# EAGLE design tweeq-FB_Audio (EAGLE 7.2.0)
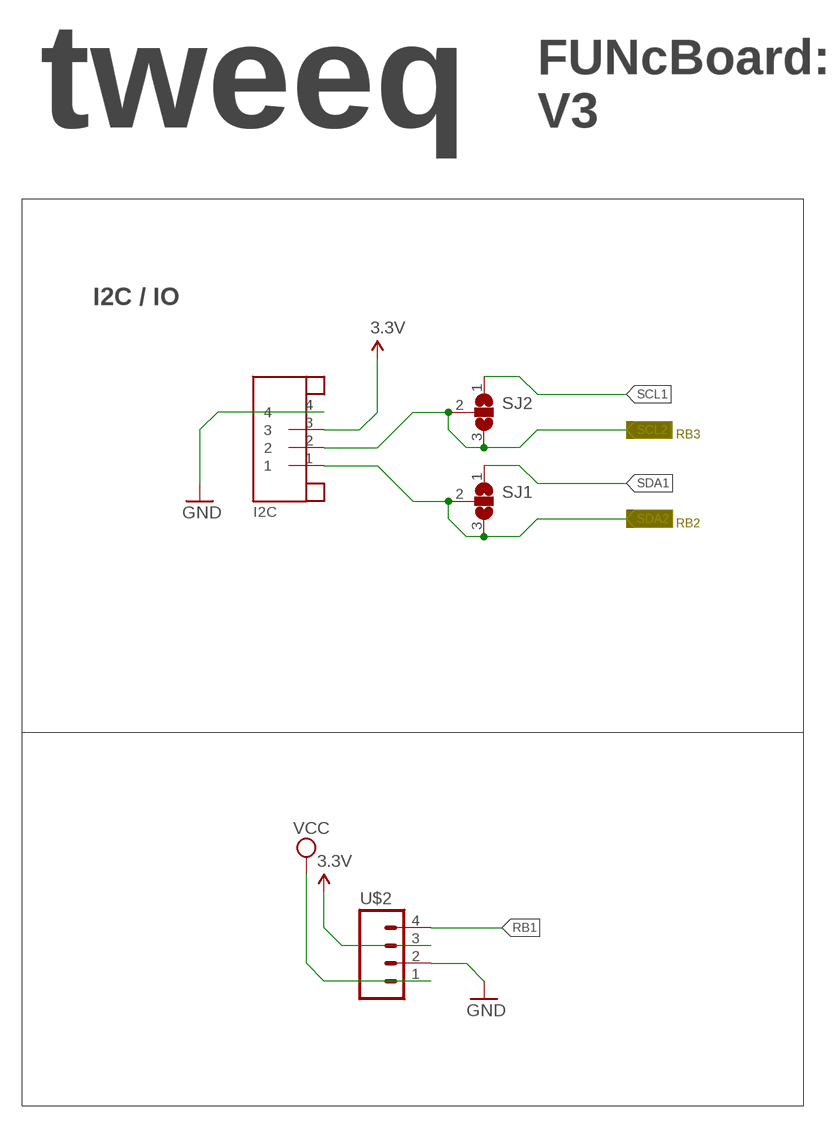
[diagram p0: schematic, sheet 1, part 1 of 2]
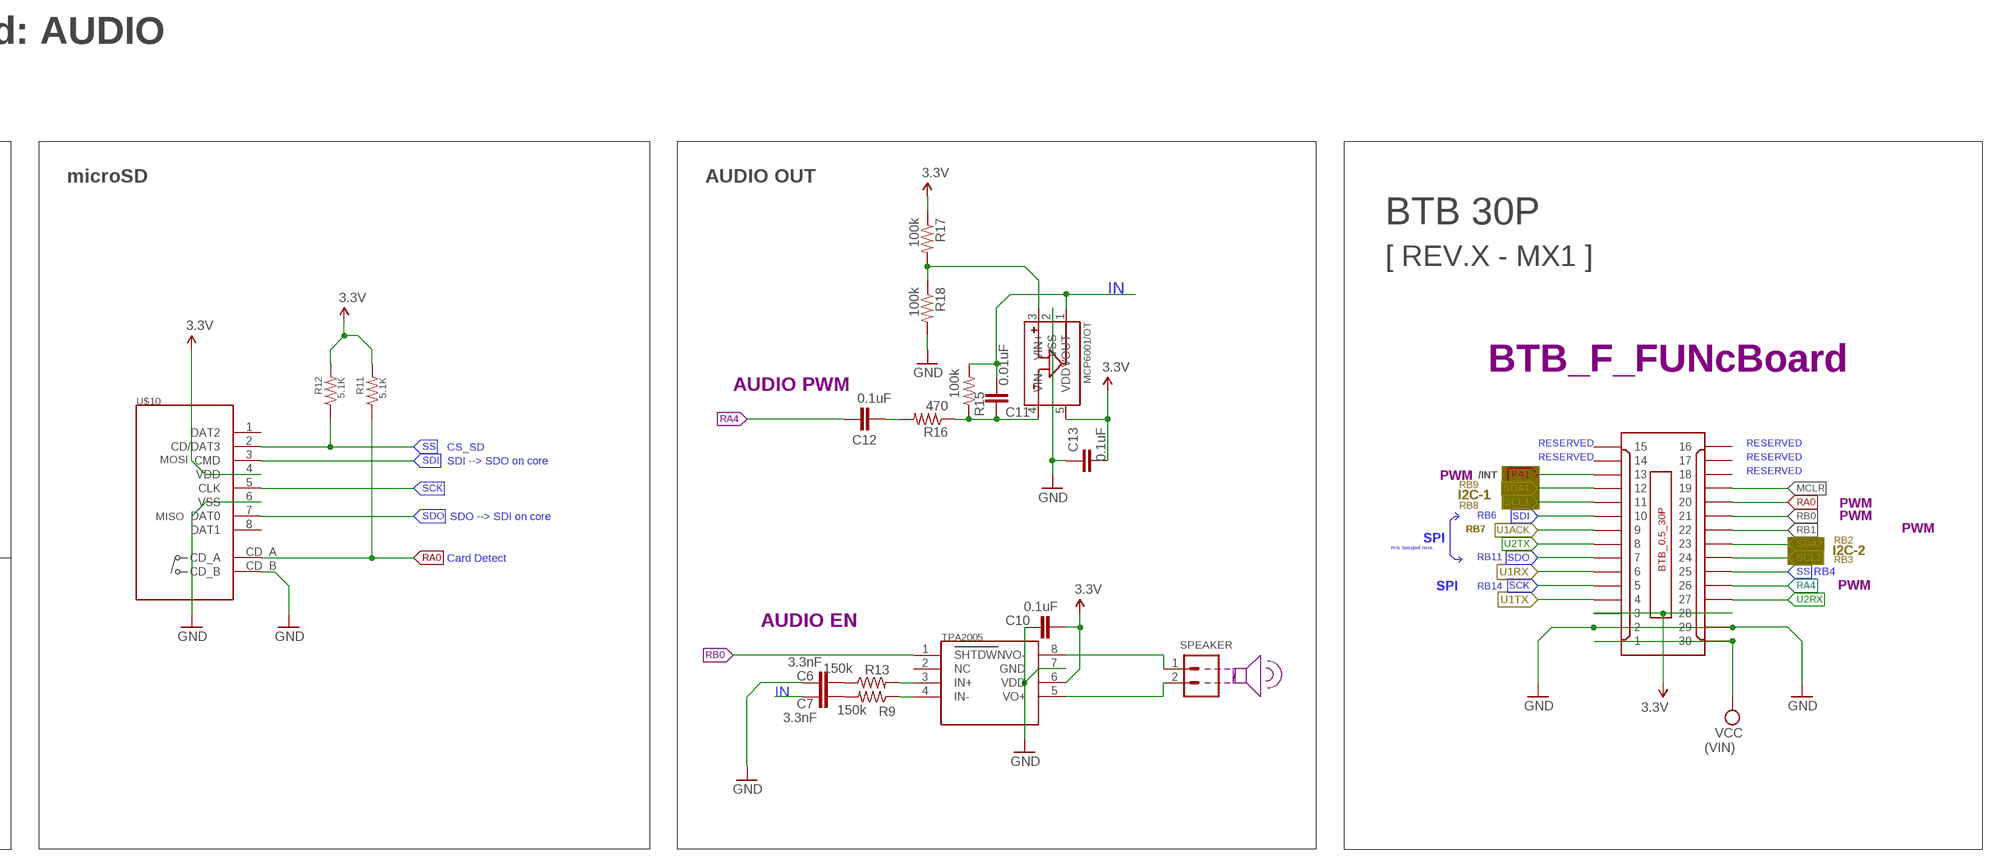
[diagram p1: schematic, sheet 1, part 2 of 2]

## Parts
C6  3.3nF  C-EUC0402  [C0402]
C7  3.3nF  C-EUC0402  [C0402]
C10  0.1uF  C-EUC0402  [C0402]
C11  0.01uF  C-EUC0402  [C0402]
C12  0.1uF  C-EUC0402  [C0402]
C13  0.1uF  C-EUC0402  [C0402]
I2C  JST-4PINSH  [SH1.0-4PIN]
MCP6001/OT  MCP6001/OT  [SOT23-5]
R9  150k  R-US_R0402  [R0402]
R11  5.1K  R-US_R0402  [R0402]
R12  5.1K  R-US_R0402  [R0402]
R13  150k  R-US_R0402  [R0402]
R15  100k  R-US_R0402  [R0402]
R16  470  RESISTOR0402-RES  [0402-RES]
R17  100k  R-US_R0402  [R0402]
R18  100k  R-US_R0402  [R0402]
SJ1  JUMPER_SJ2WS  [JUMPER_SJ_S]
SJ2  JUMPER_SJ2WS  [JUMPER_SJ_S]
SPEAKER  LOUDSPEAKER  M02PTH  [1X02]
TPA2005  TPA2005  [MSOP8]
U$1  BTB_CONN_30P/F  [BTB0.5-30F-3.0G]
U$2  M04  [1X04_PAD]
U$10  MICROSD_DM3D  [DM3D-SF]

## Nets
3.3V: C10.2 C13.2 I2C.3 MCP6001/OT.5(VDD) R11.2 R12.2 R17.1 TPA2005.6(VDD) U$1.3 U$1.28 U$2.3 U$10.4(VDD)
GND: C6.1 C10.1 C13.1 I2C.4 MCP6001/OT.2(VSS) R18.2 TPA2005.7(GND) U$1.2 U$1.29 U$2.2 U$10.6(VSS) U$10.CD_B
IN: C7.2 C11.2 MCP6001/OT.1(VOUT) R15.2
MCLR: U$1.19
N$12: R9.1 TPA2005.4(IN-)
N$13: C7.1 R9.2
N$14: R13.2 TPA2005.3(IN+)
N$22: C6.2 R13.1
N$23: SPEAKER.1 TPA2005.8(VO-)
N$24: SPEAKER.2 TPA2005.5(VO+)
N$25: C12.2 R16.2
N$26: C11.1 MCP6001/OT.4(VIN-) R15.1 R16.1
N$27: MCP6001/OT.3(VIN+) R17.2 R18.1
RA0: R11.1 U$1.20 U$10.CD_A
RA1: U$1.13
RA4: C12.1 U$1.26
RB0: TPA2005.1(SHTDWN) U$1.21
RB1: U$1.22 U$2.4
SCK: U$1.5 U$10.5(CLK)
SCL1: SJ2.1 U$1.11
SCL2: I2C.2 SJ2.2 SJ2.3 U$1.24
SDA1: SJ1.1 U$1.12
SDA2: I2C.1 SJ1.2 SJ1.3 U$1.23
SDI: U$1.10 U$10.3(CMD)
SDO: U$1.7 U$10.7(DAT0)
SS: R12.1 U$1.25 U$10.2(CD/DAT3)
U1ACK: U$1.9
U1RX: U$1.6
U1TX: U$1.4
U2RX: U$1.27
U2TX: U$1.8
VCC: U$1.1 U$1.30 U$2.1
Unconnected: TPA2005.2(NC) U$1.14 U$1.15 U$1.16 U$1.17 U$1.18 U$10.1(DAT2) U$10.8(DAT1)

## Notes on the sheet
- FUNcBoard: AUDIO
- tweeq | V3
- microSD | AUDIO OUT
- I2C / IO | BTB 30P
- [ REV.X - MX1 ]
- RB3
- BTB_F_FUNcBoard
- AUDIO PWM
- RB2
- RESERVED | RESERVED
- CS_SD
- RESERVED | RESERVED
- MOSI | SDI --> SDO on core
- PWM | /INT
- RESERVED
- RB9
- I2C-1
- I2C-1
- RB8 | PWM
- MISO | SDO --> SDI on core | RB6 | PWM
- RB7
- SPI | PWM
- RB2
- Pins Swapped Here.
- I2C-2
- Card Detect | RB11 | I2C-2
- RB3
- RB4
- SPI
- RB14 | PWM
- AUDIO EN
- (VIN)

## Library data of the parts
C6 C7 C10-C13 = AISCube:C-EU: CAPACITOR, European symbol
I2C = AISCube:JST-4PIN: JST 4 Pin
MCP6001/OT = AISCube:MCP6001: MCP6001 1 MHz Bandwidth Low Power Op Amp
R9 R13 R15 R17 R18 = AISCube:R-US_: RESISTOR, American symbol
R11 R12 = rcl:R-US_: RESISTOR, American symbol
R16 = SparkFun:RESISTOR: Resistor Basic schematic elements and footprints for 0603, 1206, and PTH resistors.
SJ1 SJ2 = AISCube:JUMPER_SJ2W: SMD solder JUMPER
SPEAKER = AISCube:M02: Header 2 Standard 2-pin 0.1" header. Use with straight break away headers (SKU : PRT-00116), right angle break away headers (PRT-00553), swiss pins (PRT-00743), machine pins (PRT-00117), and female headers (PRT-00115). Molex polarized connector foot print use with SKU : PRT-08233 with associated crimp pins and housings.
TPA2005 = AISCube:TPA2005: TPA2005 1.4-W MONO FILTER-FREE CLASS-D AUDIO POWER AMPLIFIER
U$1 = AISCube:BTB_CONN_30P: Board to Board Connector SMD 0.5mm Pitch 30 way - Dual Side (2x15) Total Mating height: 3.0mm
U$2 = AISCube:M04: 1x04 Pin Header Standard 2.54mm (0.1") header.
U$10 = AISCube:MICROSD_DM3D: DM3D-SF HRS (HIROSE) - DM3D-SF - CONNECTOR, MICRO SD, PUSH PULL, SMT, R/A Manufacturer: HRS (HIROSE) Order Code: 1764377RL (e14) Manufacturer Part No: DM3D-SF

## Board
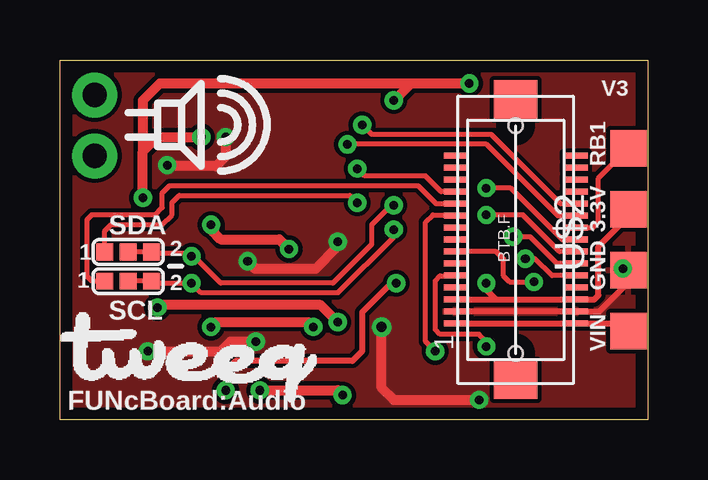
[diagram p2: board, top side]
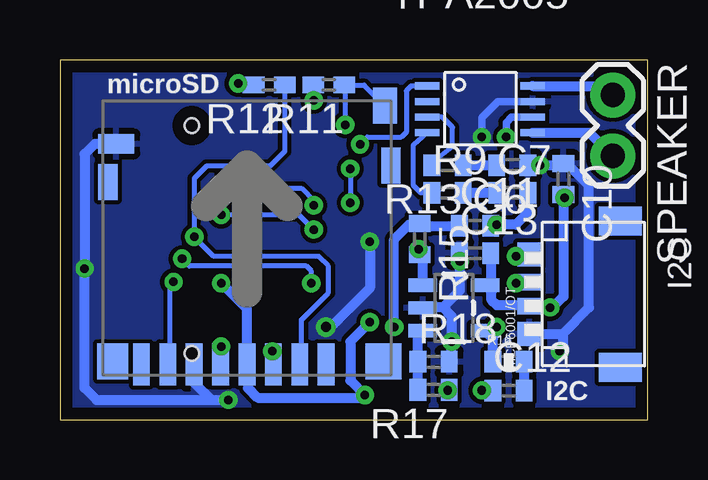
[diagram p3: board, bottom side, seen from below]

Size 24.5 x 15 mm. Coordinates in mm from the lower left corner, seen from the top.
Outline: 0,15 24.5,15 24.5,0 0,0 0,15
Copper layers (1*16): Top 0.0356mm / dielectric 1.5011mm / Bottom 0.0356mm
Design rules "AISCube": minimum track width 7mil, minimum drill 14mil, track to track 7mil, track to pad 7mil, pad to pad 7mil, via to via 7mil, smd to smd 0mil, copper to edge 20mil, drill to drill 8mil, minimum pad ring 10mil, minimum via ring 8mil, stop-mask expansion 4mil, vias tented up to drill 32mil, thermal gap 10mil

### Footprints (pad centres in the part's own frame; a part is rotated, then mirrored left to right if it is on the bottom)
C0402 = smd 0.7 x 0.9: 1 -0.65,0; 2 0.65,0
SH1.0-4PIN = smd 1 x 1: 1 -1.65,-0.55; 4 1.65,-0.55 | smd 0.7 x 1: 2 -0.5,-0.55; 3 0.5,-0.55 | smd 1.2 x 1.8: P$1 -3.05,3.25; P$2 3.05,3.25
SOT23-5 = smd 0.55 x 1.2: 1 -0.95,-1.3; 2 0,-1.3; 3 0.95,-1.3; 4 0.95,1.3; 5 -0.95,1.3
R0402 = smd 0.7 x 0.9: 1 -0.65,0; 2 0.65,0
R0402' = smd 0.9 x 0.7: 1 -0.65,0; 2 0.65,0
0402-RES = smd 0.7 x 0.9: 1 -0.65,0; 2 0.65,0
JUMPER_SJ_S = smd 0.7 x 0.7: 1 -0.974,-0.02; 2 0,-0.02; 3 0.974,-0.02
1X02 = drill 1.016 pad 1.88: 1 0,0; 2 2.54,0
MSOP8 = smd 1.02 x 0.3: 1 -2,-0.55; 2 -2,-1.2; 3 -2,-1.85; 4 -2,-2.5; 5 2.4,-2.5; 6 2.4,-1.85; 7 2.4,-1.2; 8 2.4,-0.55
BTB0.5-30F-3.0G = smd 0.25 x 1: 1 -3.495,2.49; 2 -2.995,2.49; 3 -2.495,2.49; 4 -1.995,2.49; 5 -1.495,2.49; 6 -0.995,2.49; 7 -0.495,2.49; 8 0.005,2.49; 9 0.505,2.49; 10 1.005,2.49; 11 1.505,2.49; 12 2.005,2.49; 13 2.505,2.49; 14 3.005,2.49; 15 3.505,2.49; 16 3.505,-2.51; 17 3.005,-2.51; 18 2.505,-2.51; 19 2.005,-2.51; 20 1.505,-2.51; 21 1.005,-2.51; 22 0.505,-2.51; 23 0.005,-2.51; 24 -0.495,-2.51; 25 -0.995,-2.51; 26 -1.495,-2.51; 27 -1.995,-2.51; 28 -2.495,-2.51; 29 -2.995,-2.51; 30 -3.495,-2.51 | smd 1.6 x 1.8: P$1 -5.845,0; P$2 5.855,0 | hole 0.6: -4.745,0; 4.755,0
1X04_PAD = smd 1.524 x 1.524: 1 -3.81,0; 2 -1.27,0; 3 1.27,0; 4 3.81,0
DM3D-SF = smd 0.7 x 1.75: 1 3.3,0; 2 2.2,0; 3 1.1,0; 4 0,0; 5 -1.1,0; 6 -2.2,0; 7 -3.3,0; 8 -4.4,0 | smd 1 x 1.5: CD_A 5.75,10.8 | smd 1.5 x 0.8: CD_B -5.45,9.2 | smd 1.3 x 1.5: M0 -5.6,0.12 | smd 1.5 x 1.5: M1 5.7,0.12 | smd 0.8 x 1.5: M2 -5.8,7.6; M3 6,8.3

### Placement (x,y rotation side)
C6  5.64,10.61 180 bottom
C7  5.64,9.45 0 bottom
C10  3.51,10.03 270 bottom
C11  7.19,8.08 0 bottom
C12  5.8,1.21 0 bottom
C13  7.19,6.94 0 bottom
I2C  4.38,5.23 270 bottom
MCP6001/OT  8.07,4.66 270 bottom
R9  8.33,9.45 0 bottom
R11  5.1K  [R0402']  13.29,13.96 180 bottom
R12  5.1K  [R0402']  15.78,13.96 180 bottom
R13  8.33,10.61 180 bottom
R15  9.5,7.52 270 bottom
R16  5.8,2.41 0 bottom
R17  8.92,1.24 180 bottom
R18  8.92,2.41 0 bottom
SJ1  2.84,7.01 0 top
SJ2  2.84,5.79 0 top
SPEAKER  1.45,13.53 270 bottom
TPA2005  7.19,14.46 0 bottom
U$1  19,7.5 90 top
U$2  23.7,7.5 90 top
U$4  [TWEEQ-LOGO-L]  0,0.71 0 top
U$10  16.7,2.3 0 bottom

### Tracks (layer width: path | path; a pad name or v marks a point on that pad's centre or on a via)
3.3V  (via drill 0.36)
  Top 0.254: U$1.3 18.19,5 | 18.19,5 U$1.28 22.28,5 22.45,5.18 22.45,7.21 23.7,8.46 U$2.3 | v17.78,5.69 17.78,5.41 18.19,5
  Top 0.406: v8.33,1.22 11.58,1.22 v11.79,1.02 | 3.45,11.18 4.06,11.79 v5.89,11.79 | v17.07,14.02 14.63,14.02 | 14.63,14.02 v13.92,13.31 | v3.45,9.25 3.45,11.18 | 14.63,14.02 4.17,14.02 3.45,13.31 3.45,11.18 | v11.58,4.06 10.87,4.78 4.17,4.78 v4.06,4.67
  Bottom 0.305: TPA2005.6 5.67,12.61 5.89,12.39 v5.89,11.79
  Bottom 0.406: C13.2 6.54,5.84 MCP6001/OT.5 6.5,5.34 6.5,4.98 6.3,4.78 4.97,4.78 I2C.3 4.88,4.78 4.78,4.67 v4.06,4.67 3.96,4.67 3.51,5.13 C10.2 3.51,8.99 v3.45,9.25 | v11.58,4.06 12.39,3.25 12.39,1.63 v11.79,1.02 11.89,0.91 16.26,0.91 16.66,1.32 16.66,2.26 U$10.4 16.7,4.61 v17.78,5.69 | R17.1 8.31,1.24 v8.33,1.22 | R12.2 16.49,14.02 v17.07,14.02 | v13.92,13.31 13.92,13.94 R11.2
GND  (via drill 0.36, 0.41)
  Top 0.254: U$1.2 U$1.29 22.49,4.5 23.7,5.72 U$2.2 | 23.37,5.59 v23.47,6.3
  Top 0.406: v3.66,2.85 6.71,2.85 7.11,3.25 v8.17,3.25 | v13.41,3.86 13.41,1.33 13.92,0.82 v17.48,0.82 | v6.91,11.79 6.91,10.97 6.5,10.57 4.52,10.57 v4.47,10.61 | v7.82,6.6 8.13,6.3 10.67,6.3 11.58,7.21 v11.58,7.42 | U$2.2 23.44,6.23 v23.47,6.3
  Bottom 0.305: TPA2005.7 6.24,13.26 6.91,12.6 v6.91,11.79
  Bottom 0.406: 8.53,4.67 9.36,4.67 MCP6001/OT.2 9.39,4.67 | 8.53,4.67 7.82,5.38 v7.82,6.6 7.82,6.92 C13.1 | 8.53,4.67 8.17,4.31 v8.17,3.25 8.17,2.51 R18.2 | 3.53,3.58 2.44,4.67 2.44,9.75 3.36,10.68 C10.1 3.58,10.61 v4.47,10.61 C6.1 | 3.53,3.58 3.53,2.97 v3.66,2.85 | I2C.4 3.53,3.58 | 21.86,11.5 U$10.CD_B 23.05,11.5 23.47,11.07 v23.47,6.3 23.47,1.32 22.97,0.82 v17.48,0.82 v17.48,0.81 18.19,0.81 18.9,1.53 U$10.6 | v11.58,7.42 11.58,5.49 13.21,3.86 v13.41,3.86
  pour Top: 0.2,14.83 24.26,14.83 24.26,0.2 0.2,0.2
  pour Bottom: 0.2,14.83 24.26,14.83 24.26,0.2 0.2,0.2
IN  (via drill 0.36)
  Top 0.406: v6.3,8.13 6.3,7.92 6.71,7.52 9.14,7.52 v9.55,7.11
  Bottom 0.406: C7.2 4.99,8.62 5.49,8.13 v6.3,8.13 | v6.3,8.13 6.56,8.13 C11.2 6.35,8.07 v6.3,8.13 | MCP6001/OT.1 9.37,6.75 R15.2 9.5,6.76 v9.55,7.11
N$12
  Bottom 0.203: R9.1 9.45,9.45 9.75,9.75 9.75,11.47 TPA2005.4
N$13
  Bottom 0.406: C7.1 R9.2
N$14
  Bottom 0.203: R13.2 8.98,10.73 8.13,11.38 8.13,12.19 8.55,12.61 TPA2005.3
N$22
  Bottom 0.406: R13.1 C6.2
N$23
  Bottom 0.406: TPA2005.8 1.83,13.91 SPEAKER.1
N$24
  Bottom 0.406: TPA2005.5 2.42,11.96 SPEAKER.2
N$25
  Bottom 0.406: C12.2 R16.2
N$26  (via drill 0.36)
  Top 0.406: v6.3,3.86 6.5,4.06 10.36,4.06 v10.57,3.86
  Bottom 0.406: R16.1 6.45,3.38 MCP6001/OT.4 6.45,3.71 v6.3,3.86 | C11.1 9.4,8.07 R15.1 9.54,8.13 9.96,8.13 10.57,7.52 v10.57,3.86
N$27
  Bottom 0.406: MCP6001/OT.3 9.57,3.51 R18.1 R17.2
RA0  (via drill 0.36)
  Top 0.203: v12.6,12.29 13.01,11.89 17.98,11.89 20.86,9.01 U$1.20
  Bottom 0.203: U$10.CD_A 11.81,13.96 R11.1 12.6,13.91 v12.6,12.29
RA4  (via drill 0.36)
  Top 0.203: 21.5,5.99 U$1.26 20.51,6 19.81,6.71 v19.41,6.71
  Top 0.254: v6.91,1.22 6.91,2.03 7.32,2.44 12.19,2.44 12.6,2.85 12.6,4.47 13.82,5.69 v14.02,5.69
  Bottom 0.203: C12.1 6.9,1.21 v6.91,1.22 | v14.02,5.69 14.02,6.2 14.22,6.4 19.1,6.4 v19.41,6.71
RB0  (via drill 0.36)
  Top 0.203: v11.99,11.48 17.78,11.48 20.76,8.51 U$1.21
  Bottom 0.203: TPA2005.1 9.86,13.91 10.06,13.72 10.06,11.99 10.26,11.79 11.68,11.79 v11.99,11.48
RB1
  Top 0.203: U$1.22 22.23,8.01 22.45,8.23 22.45,10.06 U$2.4
SCK  (via drill 0.36)
  Top 0.203: v17.78,3.05 17.78,3.25 17.48,3.56 15.85,3.56 15.65,3.76 15.65,5.79 15.85,5.99 16.5,5.99 U$1.5
  Bottom 0.203: v17.78,3.05 17.78,2.32 U$10.5
SCL1
  Top 0.203: U$1.11 15.68,9.01 14.94,9.75 4.57,9.75 4.27,9.45 4.27,8.84 3.96,8.53 1.32,8.53 1.12,8.33 1.12,5.99 1.32,5.79 1.85,5.79 SJ2.1
SCL2  (via drill 0.36)
  Top 0.203: SJ2.2 SJ2.3 4.04,5.69 v5.49,5.69 5.89,5.28 11.58,5.28 13.92,7.62 v13.92,7.92 | U$1.24 20.83,7.01 19.3,8.53 v17.78,8.53
  Bottom 0.203: v5.49,5.69 4.97,5.69 I2C.2 | v17.78,8.53 14.53,8.53 v13.92,7.92
SDA1  (via drill 0.36)
  Top 0.203: SJ1.1 1.87,7.87 2.13,8.13 4.27,8.13 4.67,8.53 4.67,9.04 4.98,9.35 12.09,9.35 v12.39,9.04 | U$1.12 15.89,9.51 15.24,10.16 12.7,10.16 v12.39,10.46
  Bottom 0.203: v12.39,10.46 v12.39,9.04
SDA2  (via drill 0.36)
  Top 0.203: SJ1.2 SJ1.3 3.82,6.95 5.34,6.95 v5.49,6.81 5.59,6.81 6.71,5.69 11.38,5.69 13.01,7.32 13.01,8.13 13.82,8.94 v13.92,8.94 | U$1.23 20.94,7.5 18.8,9.65 v17.78,9.65
  Bottom 0.203: v5.49,6.81 5,6.81 I2C.1 | v17.78,9.65 14.43,9.65 13.92,9.14 v13.92,8.94
SDI  (via drill 0.36)
  Top 0.203: v15.65,2.85 15.24,3.25 15.24,8.23 15.54,8.53 16.48,8.53 U$1.10
  Bottom 0.203: v15.65,2.85 15.65,2.34 U$10.3
SDO  (via drill 0.36)
  Top 0.203: v19.76,5.74 18.75,5.74 18.49,5.99 18.49,6.71 18.19,7.01 U$1.7
  Bottom 0.203: 19.91,2.39 19.91,5.59 v19.76,5.74
  Bottom 0.254: U$10.7 19.91,2.39
SS  (via drill 0.36)
  Top 0.203: U$1.25 20.72,6.5 19.61,7.62 v18.9,7.62
  Bottom 0.203: U$10.2 14.43,2.37 14.43,4.17 13.31,5.28 13.31,6.4 13.72,6.81 18.09,6.81 v18.9,7.62 18.9,10.06 18.39,10.57 15.75,10.57 15.13,11.19 R12.1
VCC
  Top 0.254: U$1.1 U$1.30 23.39,4 U$2.1

### Text on the board
tPlace: V3 | RB1 | SDA | 3.3V | 1 | 2 | 1 | 2 | GND | SCL | VIN | FUNcBoard:Audio
bPlace: microSD | I2C